# EAGLE design OSO-MISC-20-005 Sensor Cap Breakout (EAGLE 9.4.2)
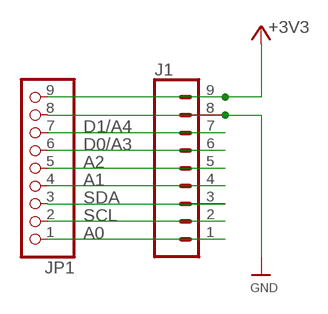
[diagram p0: schematic, sheet 1]

## Parts
J1  CONN_09NO_SILK  [1X09_NO_SILK]
JP1  HEADER-1X9_JSTSH  [JST_SH9]

## Nets
+3V3: J1.9 JP1.9
A0: J1.1 JP1.1
A1: J1.4 JP1.4
A2: J1.5 JP1.5
D0/A3: J1.6 JP1.6
D1/A4: J1.7 JP1.7
GND [gnd]: J1.8 JP1.8
SCL: J1.2 JP1.2
SDA: J1.3 JP1.3

## Library data of the parts
J1 = SparkFun-Connectors:CONN_09: Multi connection point. Often used as Generic Header-pin footprint for 0.1 inch spaced/style header connections On any of the 0.1 inch spaced packages, you can populate with these: Break Away Headers - Straight <https://www.sparkfun.com/products/116> (PRT-00116) Break Away Male Headers - Right Angle <https://www.sparkfun.com/products/553> (PRT-00553) Female Headers <https://www.sparkfun.com/products/115> (PRT-00115) Break Away Headers - Machine Pin <https://www.sparkfun.com/products/117> (PRT-00117) Break Away Female Headers - Swiss Machine Pin <https://www.sparkfun.com/products/743> (PRT-00743) For SCREWTERMINALS and SPRING TERMINALS visit here: Screw Terimnals on SparkFun.com <https://www.sparkfun.com/search/results?term=Screw+Terminals> (5mm/3.5mm/2.54mm spacing) This device is also useful as a general connection point to wire up your design to another part of your project. Our various solder wires solder well into these plated through hole pads. Hook-Up Wire - Assortment (Stranded, 22 AWG) <https://www.sparkfun.com/products/11375> (PRT-11375) Hook-Up Wire - Assortment (Solid Core, 22 AWG) <https://www.sparkfun.com/products/11367> (PRT-11367) View the entire wire category on our website here <https://www.sparkfun.com/categories/141> Special notes: Molex polarized connector foot print use with SKU : PRT-08231 with associated crimp pins and housings. 1MM SMD Version SKU: PRT-10208 NOTES ON THE VARIANTS LOCK and LOCK_LONGPADS... This footprint was designed to help hold the alignment of a through-hole component (i.e. 6-pin header) while soldering it into place. You may notice that each hole has been shifted either up or down by 0.005 of an inch from it's more standard position (which is a perfectly straight line). This slight alteration caused the pins (the squares in the middle) to touch the edges of the holes. Because they are alternating, it causes a "brace" to hold the component in place. 0.005 has proven to be the perfect amount of "off-center" position when using our standard breakaway headers. Although looks a little odd when you look at the bare footprint, once you have a header in there, the alteration is very hard to notice. Also,if you push a header all the way into place, it is covered up entirely on the bottom side.
JP1 = microbuilder:HEADER-1X9: PIN HEADER

## Net classes
0 default: width 0.152 mm, drill 0.254 mm
1 power: width 0.305 mm, drill 0.305 mm

## Board
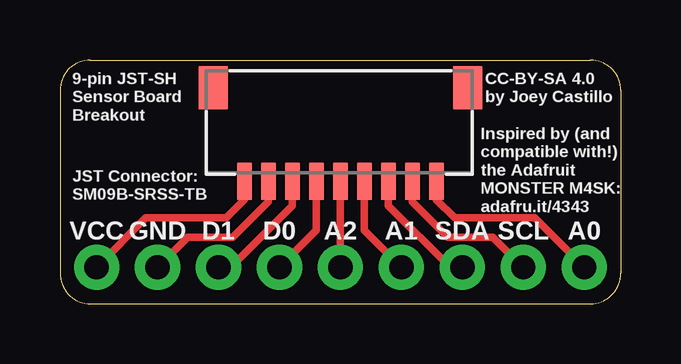
[diagram p1: board, top side]
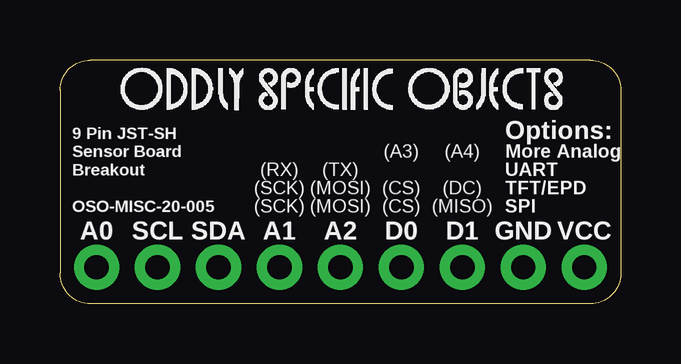
[diagram p2: board, bottom side, seen from below]

Size 23.37 x 10.16 mm. Coordinates in mm from the lower left corner, seen from the top.
Outline: 23.37,8.89 arc90 22.1,10.16 1.27,10.16 arc90 0,8.89 0,1.27 arc90 1.27,0 22.1,0 arc90 23.37,1.27 23.37,8.89
Copper layers (1*16): Top 0.035559375mm / dielectric 1.6mm / Bottom 0.035559375mm
Design rules "oshpark-2layer *": minimum track width 6mil, minimum drill 10mil, track to track 6mil, track to pad 6mil, pad to pad 6mil, via to via 6mil, smd to smd 6mil, copper to edge 15mil, drill to drill 6mil, minimum pad ring 5mil, minimum via ring 5mil, stop-mask expansion 2.5mil, vias tented up to drill 12mil, thermal gap 10mil

### Footprints (pad centres in the part's own frame; a part is rotated, then mirrored left to right if it is on the bottom)
1X09_NO_SILK = drill 1.016 pad 1.88: 1 0,0; 2 2.54,0; 3 5.08,0; 4 7.62,0; 5 10.16,0; 6 12.7,0; 7 15.24,0; 8 17.78,0; 9 20.32,0
JST_SH9 = smd 0.6 x 1.55: 1 -4,2.514; 2 -3,2.514; 3 -2,2.514; 4 -1,2.514; 5 0,2.514; 6 1,2.514; 7 2,2.514; 8 3,2.514; 9 4,2.514 | smd 1.2 x 1.8: MT1 -5.3,-1.386; MT2 5.3,-1.386

### Placement (x,y rotation side)
J1  21.84,1.52 180 top
JP1  11.68,7.62 180 top
U$1  [OSO_WORDMARK_ONELINE_725MIL_1000DPI]  20.89,8 0 bottom

### Tracks (layer width: path | path; a pad name or v marks a point on that pad's centre or on a via)
+3V3
  Top 0.305: JP1.9 7.68,4.34 6.92,3.58 3.58,3.58 J1.9
A0
  Top 0.305: JP1.1 15.68,4.34 16.45,3.58 19.79,3.58 J1.1
A1
  Top 0.305: JP1.4 12.68,3.06 J1.4
A2
  Top 0.305: JP1.5 J1.5
D0/A3
  Top 0.305: JP1.6 10.68,3.06 J1.6
D1/A4
  Top 0.305: J1.7 7.12,1.52 9.68,4.09 JP1.7
GND
  Top 0.305: J1.8 4.08,1.52 5.33,2.77 7.21,2.77 8.68,4.25 JP1.8
SCL
  Top 0.305: J1.2 19.29,1.52 18.04,2.77 16.16,2.77 14.68,4.25 JP1.2
SDA
  Top 0.305: J1.3 16.25,1.52 13.68,4.09 JP1.3

### Text on the board
tPlace: 9-pin JST-SH / Sensor Board / Breakout | CC-BY-SA 4.0 / by Joey Castillo / / Inspired by (and / compatible with!) / the Adafruit / MONSTER M4SK: / adafru.it/4343 | JST Connector: / SM09B-SRSS-TB | VCC | GND | D1 | D0 | A2 | A1 | SDA | SCL | A0
bPlace: Options: | 9 Pin JST-SH / Sensor Board / Breakout / / OSO-MISC-20-005 | More Analog | UART | (A4) | (A3) | (TX) | (RX) | TFT/EPD | (DC) | (CS) | (MOSI) | (SCK) | SPI | (MISO) | (CS) | (MOSI) | (SCK) | VCC | GND | D1 | D0 | A2 | A1 | SDA | SCL | A0